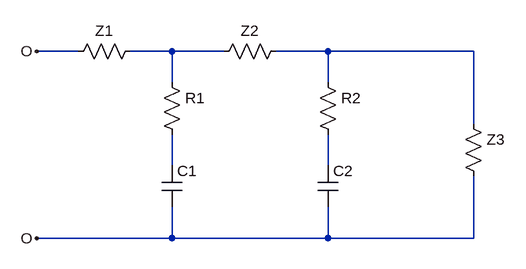
[diagram p0: schematic Circuito_1.asc]
Circuito_1.asc, the LTspice schematic file:
Version 4
SHEET 1 880 680
WIRE 64 128 0 128
WIRE 208 128 144 128
WIRE 288 128 208 128
WIRE 448 128 368 128
WIRE 672 128 448 128
WIRE 208 176 208 128
WIRE 448 176 448 128
WIRE 672 240 672 128
WIRE 208 304 208 256
WIRE 448 304 448 256
WIRE 208 416 208 368
WIRE 208 416 0 416
WIRE 448 416 448 368
WIRE 448 416 208 416
WIRE 672 416 672 320
WIRE 672 416 448 416
FLAG 0 128 O
FLAG 0 416 O
SYMBOL res 160 112 R90
WINDOW 0 0 56 VBottom 2
WINDOW 3 32 56 VTop 2
SYMATTR InstName Z1
SYMATTR Value ""
SYMBOL res 384 112 R90
WINDOW 0 0 56 VBottom 2
WINDOW 3 32 56 VTop 2
SYMATTR InstName Z2
SYMATTR Value ""
SYMBOL res 656 224 R0
SYMATTR InstName Z3
SYMATTR Value ""
SYMBOL res 192 160 R0
SYMATTR InstName R1
SYMATTR Value ""
SYMBOL res 432 160 R0
SYMATTR InstName R2
SYMATTR Value ""
SYMBOL cap 192 304 R0
SYMATTR InstName C1
SYMATTR Value ""
SYMBOL cap 432 304 R0
SYMATTR InstName C2
SYMATTR Value ""

The netlist it stands for:
* Circuito_1.asc
R§Z1 N001 O
R§Z2 N002 N001
R§Z3 N002 O
R1 N001 N003
R2 N002 N004
C1 N003 O
C2 N004 O
.backanno
.end